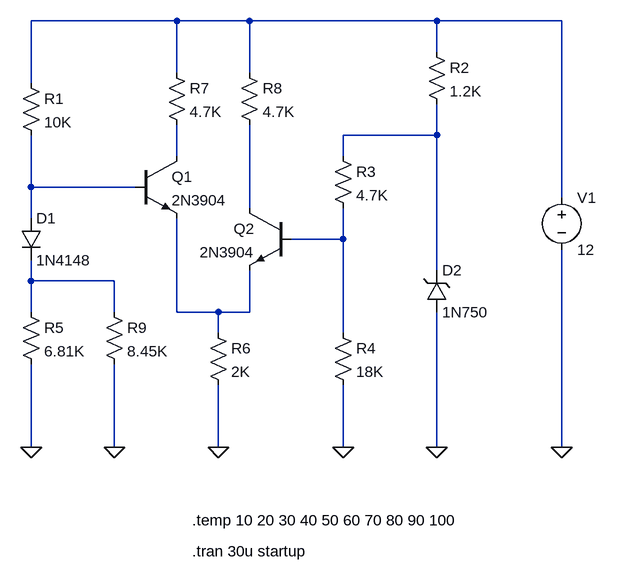
[diagram p0: schematic thermometer.asc]
thermometer.asc, the LTspice schematic file:
Version 4
SHEET 1 920 680
WIRE 272 -320 48 -320
WIRE 384 -320 272 -320
WIRE 672 -320 384 -320
WIRE 864 -320 672 -320
WIRE 672 -272 672 -320
WIRE 272 -240 272 -320
WIRE 384 -240 384 -320
WIRE 48 -224 48 -320
WIRE 672 -144 672 -192
WIRE 672 -144 528 -144
WIRE 272 -112 272 -160
WIRE 528 -112 528 -144
WIRE 48 -64 48 -144
WIRE 208 -64 48 -64
WIRE 864 -48 864 -320
WIRE 384 -32 384 -160
WIRE 48 -16 48 -64
WIRE 528 16 528 -32
WIRE 528 16 448 16
WIRE 672 64 672 -144
WIRE 48 80 48 48
WIRE 176 80 48 80
WIRE 48 128 48 80
WIRE 176 128 176 80
WIRE 272 128 272 -16
WIRE 336 128 272 128
WIRE 384 128 384 64
WIRE 384 128 336 128
WIRE 336 160 336 128
WIRE 528 160 528 16
WIRE 48 336 48 208
WIRE 176 336 176 208
WIRE 336 336 336 240
WIRE 528 336 528 240
WIRE 672 336 672 128
WIRE 864 336 864 32
FLAG 864 336 0
FLAG 672 336 0
FLAG 528 336 0
FLAG 48 336 0
FLAG 336 336 0
FLAG 176 336 0
SYMBOL diode 32 -16 R0
SYMATTR InstName D1
SYMATTR Value 1N4148
SYMBOL res 32 -240 R0
SYMATTR InstName R1
SYMATTR Value 10K
SYMBOL res 656 -288 R0
SYMATTR InstName R2
SYMATTR Value 1.2K
SYMBOL zener 656 128 M180
WINDOW 0 24 64 Left 2
WINDOW 3 24 0 Left 2
SYMATTR InstName D2
SYMATTR Value 1N750
SYMATTR Description Diode
SYMATTR Type diode
SYMBOL voltage 864 -64 R0
WINDOW 123 0 0 Left 2
WINDOW 39 0 0 Left 2
SYMATTR InstName V1
SYMATTR Value 12
SYMBOL res 512 -128 R0
SYMATTR InstName R3
SYMATTR Value 4.7K
SYMBOL res 512 144 R0
SYMATTR InstName R4
SYMATTR Value 18K
SYMBOL res 32 112 R0
SYMATTR InstName R5
SYMATTR Value 6.81K
SYMBOL npn 208 -112 R0
SYMATTR InstName Q1
SYMATTR Value 2N3904
SYMBOL npn 448 -32 M0
SYMATTR InstName Q2
SYMATTR Value 2N3904
SYMBOL res 320 144 R0
SYMATTR InstName R6
SYMATTR Value 2K
SYMBOL res 256 -256 R0
SYMATTR InstName R7
SYMATTR Value 4.7K
SYMBOL res 368 -256 R0
SYMATTR InstName R8
SYMATTR Value 4.7K
SYMBOL res 160 112 R0
SYMATTR InstName R9
SYMATTR Value 8.45K
TEXT 296 448 Left 2 !.temp 10 20 30 40 50 60 70 80 90 100
TEXT 296 496 Left 2 !.tran 30u startup

The netlist it stands for:
* thermometer.asc
D1 N004 N007 1N4148
R1 N001 N004 10K
R2 N001 N002 1.2K
D2 0 N002 1N750
V1 N001 0 12
R3 N002 N006 4.7K
R4 N006 0 18K
R5 N007 0 6.81K
Q1 N003 N004 N008 0 2N3904
Q2 N005 N006 N008 0 2N3904
R6 N008 0 2K
R7 N001 N003 4.7K
R8 N001 N005 4.7K
R9 N007 0 8.45K
.model D D
.lib standard.dio
.model NPN NPN
.model PNP PNP
.lib standard.bjt
.temp 10 20 30 40 50 60 70 80 90 100
.tran 30u startup
.backanno
.end